# Altium schematic sheet main sheet.SchDoc
size A4
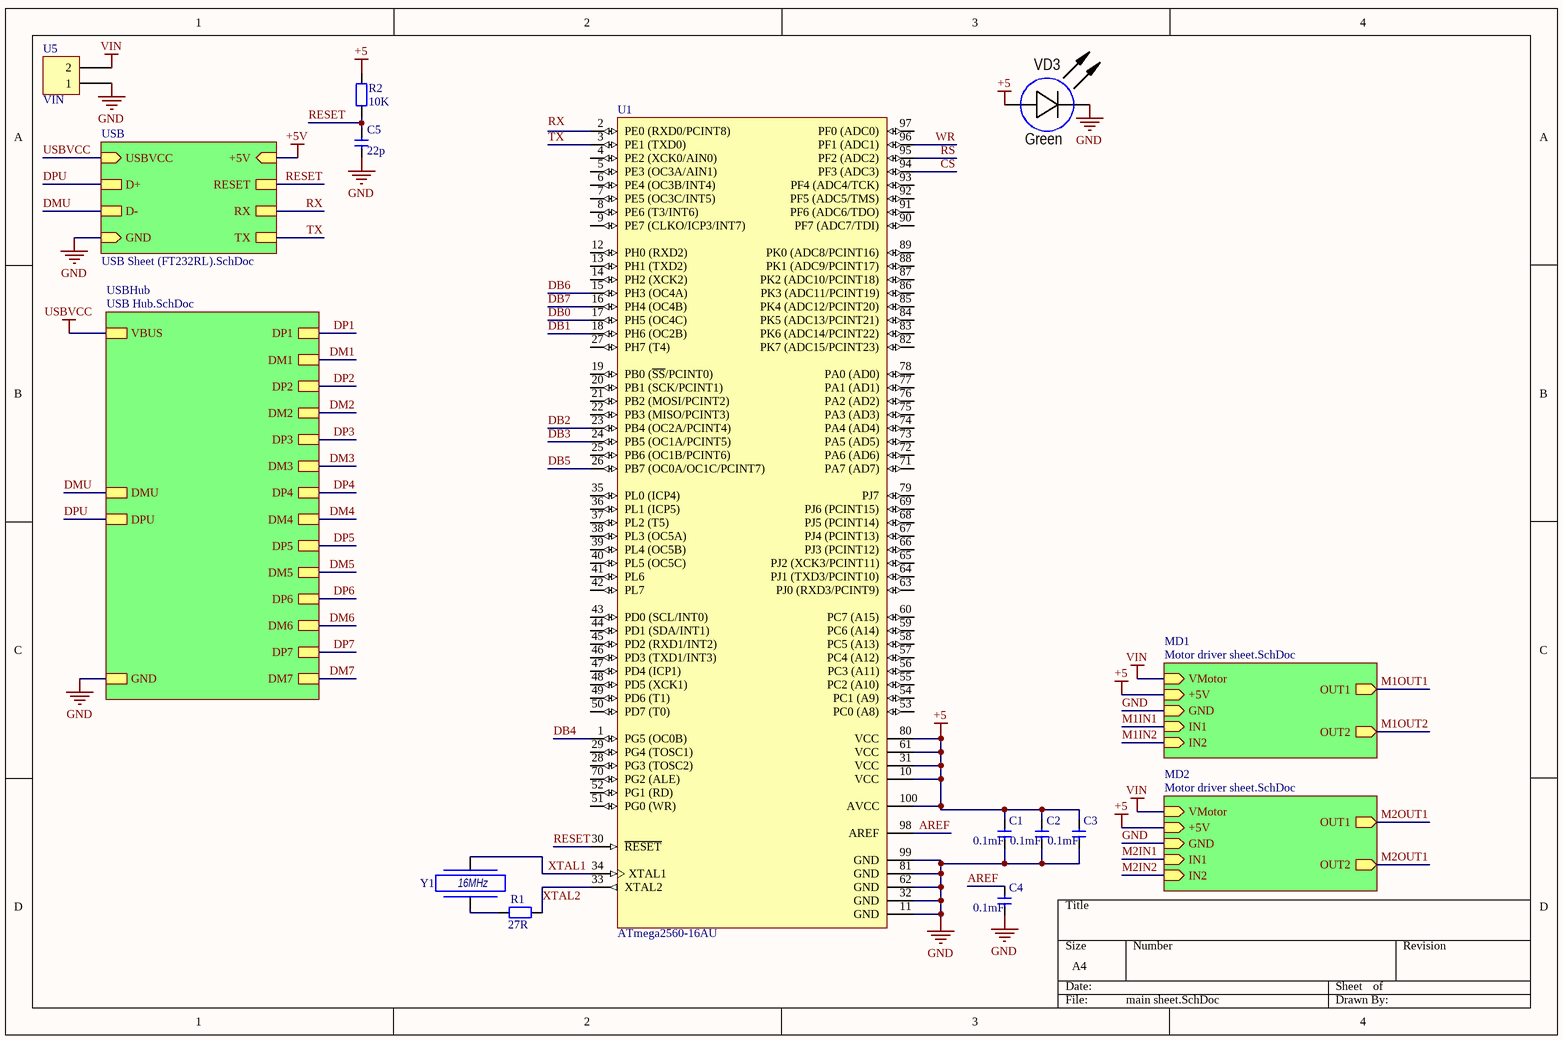
[diagram p0: main sheet.SchDoc]

## Parts
C1  0.1mF  [cap0402]
C2  0.1mF  [cap0402]
C3  0.1mF  [cap0402]
C4  0.1mF  [cap0402]
C5  22p  [cap0603]
R1  27R  [res0603]
R2  10K  [res0603]
U1  ATmega2560-16AU  [100A_N]
U5  VIN  [Power connectors]
VD3  Green  [CH0603LB]
Y1  16MHz  [QSMD5.0x3.2x1.0]

## Sub-sheets
MD1 = Motor driver sheet.SchDoc: VMotor (in), +5V (in), GND (in), IN1 (in), IN2 (in), OUT1 (out), OUT2 (out)
MD2 = Motor driver sheet.SchDoc: VMotor (in), +5V (in), GND (in), IN1 (in), IN2 (in), OUT1 (out), OUT2 (out)
USB = USB Sheet (FT232RL).SchDoc: RX, TX, RESET, +5V (in), USBVCC (in), D+, D-, GND (in)
USBHub = USB Hub.SchDoc: VBUS, DMU, DPU, GND, DM1, DM2, DM3, DM4, DM5, DM6, DM7, DP1, DP2, DP3, DP4, DP5, DP6, DP7

## Nets
+5: C1.2 C2.2 C3.2 R2.2 U1.10(VCC) U1.31(VCC) U1.61(VCC) U1.80(VCC) U1.100(AVCC) VD3.1(A) ; sheet MD1/+5V, sheet MD2/+5V
+5V: sheet USB/+5V
GND: C1.1 C2.1 C3.1 C4.1 C5.1 U1.11(GND) U1.32(GND) U1.62(GND) U1.81(GND) U1.99(GND) U5.1 VD3.2(C) ; sheet USB/GND, sheet USBHub/GND, sheet MD1/GND, sheet MD2/GND
USBVCC: sheet USB/USBVCC, sheet USBHub/VBUS
VIN: U5.2 ; sheet MD1/VMotor, sheet MD2/VMotor
AREF: C4.2 U1.98(AREF)
CS: U1.94(PF3_(ADC3))
DB0: U1.17(PH5_(OC4C))
DB1: U1.18(PH6_(OC2B))
DB2: U1.23(PB4_(OC2A/PCINT4))
DB3: U1.24(PB5_(OC1A/PCINT5))
DB4: U1.1(PG5_(OC0B))
DB5: U1.26(PB7_(OC0A/OC1C/PCINT7))
DB6: U1.15(PH3_(OC4A))
DB7: U1.16(PH4_(OC4B))
DM1: sheet USBHub/DM1
DM2: sheet USBHub/DM2
DM3: sheet USBHub/DM3
DM4: sheet USBHub/DM4
DM5: sheet USBHub/DM5
DM6: sheet USBHub/DM6
DM7: sheet USBHub/DM7
DMU: sheet USB/D-, sheet USBHub/DMU
DP1: sheet USBHub/DP1
DP2: sheet USBHub/DP2
DP3: sheet USBHub/DP3
DP4: sheet USBHub/DP4
DP5: sheet USBHub/DP5
DP6: sheet USBHub/DP6
DP7: sheet USBHub/DP7
DPU: sheet USB/D+, sheet USBHub/DPU
M1IN1: sheet MD1/IN1
M1IN2: sheet MD1/IN2
M1OUT1: sheet MD1/OUT1
M1OUT2: sheet MD1/OUT2
M2IN1: sheet MD2/IN1
M2IN2: sheet MD2/IN2
M2OUT1: sheet MD2/OUT1, sheet MD2/OUT2
RESET: C5.2 R2.1 U1.30(~{RESET}) ; sheet USB/RESET
RS: U1.95(PF2_(ADC2))
RX: sheet USB/RX
TX: U1.3(PE1_(TXD0)) ; sheet USB/TX
WR: U1.96(PF1_(ADC1))
XTAL1: U1.34(XTAL1) Y1.2
XTAL2: R1.2 U1.33(XTAL2)
NetR1_1: R1.1 Y1.1

Not connected (* = marked no-connect by the designer): U1 2(PE0_(RXD0/PCINT8)) 4(PE2_(XCK0/AIN0)) 5(PE3_(OC3A/AIN1)) 6(PE4_(OC3B/INT4)) 7(PE5_(OC3C/INT5)) 8(PE6_(T3/INT6)) 9(PE7_(CLKO/ICP3/INT7)) 12(PH0_(RXD2)) 13(PH1_(TXD2)) 14(PH2_(XCK2)) 19(PB0_(~{SS}/PCINT0)) 20(PB1_(SCK/PCINT1)) 21(PB2_(MOSI/PCINT2)) 22(PB3_(MISO/PCINT3)) 25(PB6_(OC1B/PCINT6)) 27(PH7_(T4)) 28(PG3_(TOSC2)) 29(PG4_(TOSC1)) 35(PL0_(ICP4)) 36(PL1_(ICP5)) 37(PL2_(T5)) 38(PL3_(OC5A)) 39(PL4_(OC5B)) 40(PL5_(OC5C)) 41(PL6) 42(PL7) 43(PD0_(SCL/INT0)) 44(PD1_(SDA/INT1)) 45(PD2_(RXD1/INT2)) 46(PD3_(TXD1/INT3)) 47(PD4_(ICP1)) 48(PD5_(XCK1)) 49(PD6_(T1)) 50(PD7_(T0)) 51(PG0_(WR)) 52(PG1_(RD)) 53(PC0_(A8)) 54(PC1_(A9)) 55(PC2_(A10)) 56(PC3_(A11)) 57(PC4_(A12)) 58(PC5_(A13)) 59(PC6_(A14)) 60(PC7_(A15)) 63(PJ0_(RXD3/PCINT9)) 64(PJ1_(TXD3/PCINT10)) 65(PJ2_(XCK3/PCINT11)) 66(PJ3_(PCINT12)) 67(PJ4_(PCINT13)) 68(PJ5_(PCINT14)) 69(PJ6_(PCINT15)) 70(PG2_(ALE)) 71(PA7_(AD7)) 72(PA6_(AD6)) 73(PA5_(AD5)) 74(PA4_(AD4)) 75(PA3_(AD3)) 76(PA2_(AD2)) 77(PA1_(AD1)) 78(PA0_(AD0)) 79(PJ7) 82(PK7_(ADC15/PCINT23)) 83(PK6_(ADC14/PCINT22)) 84(PK5_(ADC13/PCINT21)) 85(PK4_(ADC12/PCINT20)) 86(PK3_(ADC11/PCINT19)) 87(PK2_(ADC10/PCINT18)) 88(PK1_(ADC9/PCINT17)) 89(PK0_(ADC8/PCINT16)) 90(PF7_(ADC7/TDI)) 91(PF6_(ADC6/TDO)) 92(PF5_(ADC5/TMS)) 93(PF4_(ADC4/TCK)) 97(PF0_(ADC0))

## Notes on the sheet
- Labels drawn without touching a wire or pin: RX

## Library data of the parts
C1-C5 = Cap SMD
R1 R2 = Resistor SMD
U1 = ATmega2560-16AU: 8-bit AVR Microcontroller, 4.5-5.5V, 256KB Flash, 4KB EEPROM, 8KB SRAM, 86 GPIO pins, 100-pin TQFP, Industrial Grade (-40°C to 85°C), Pb-Free; Published: 1-Apr-2010; DatasheetVersion: revL, Aug-2007; PackageVersion: revC, Oct-2001; PackageReference: 100A; Publisher: Altium Limited; PackageDescription: 100-Pin Thin Profile Plastic Quad Flat Pack (TQFP), 14 x 14 x 1.0 mm Body, 0.5 mm Pitch; Supplier 1: Digi-Key; Supplier Part Number 1: ATMEGA2560-16AU-ND; Supplier 2: Farnell; Supplier Part Number 2: 1288330; Supplier 3: Farnell; Supplier Part Number 3: 1661740; Supplier 4: Mouser; Supplier Part Number 4: 556-ATMEGA2560-16AU; Code_JEDEC: MS-026-AED; ComponentLink1Description: Manufacturer Link; ComponentLink1URL: http://www.atmel.com/products/avr/default.asp?; ComponentLink2Description: ATmega640/1280/1281/2560/2561 Datasheet; ComponentLink2URL: http://www.atmel.com/dyn/resources/prod_documents/doc2549.pdf; ComponentLink3Description: ATmega640/1280/1281/2560/2561 Summary; ComponentLink3URL: http://www.atmel.com/dyn/resources/prod_documents/2549S.pdf; ComponentLink4Description: Atmel.com Home; ComponentLink4URL: http://www.atmel.com
U5 = Power connectors
VD3 = LED: Manufacturer: *; Model: *; HelpURL: *; ComponentKind: *; Value: *
Y1 = Crystal: Кварцевый резонатор; Value: 16MHz